# Altium schematic sheet IMD.SchDoc
size A4
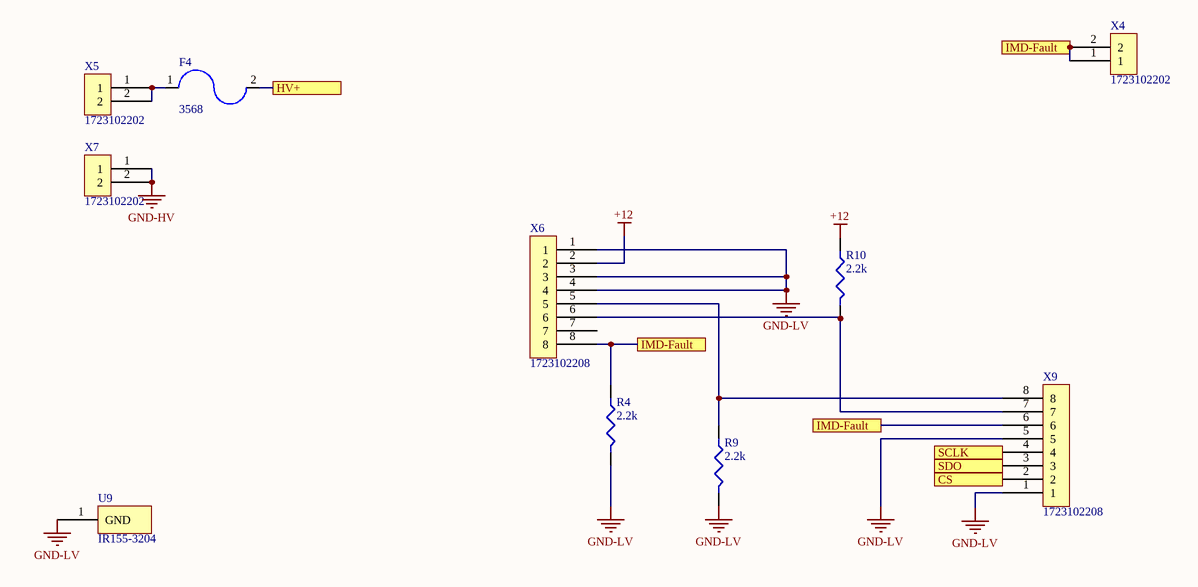
[diagram p0: IMD.SchDoc]

## Parts
F4  3568  [FUSE_MINI_HOLDER]
R4  2.2k  [R0805]
R9  2.2k  [R0805]
R10  2.2k  [R0805]
U9  IR155-3204  [IR155-3204]
X4  1723102202  [Molex2Pin]
X5  1723102202  [Molex2Pin]
X6  1723102208  [Molex8Pin]
X7  1723102202  [Molex2Pin]
X9  1723102208  [Molex8Pin]

## Ports
CS, HV+, IMD-Fault, SCLK, SDO

## Nets
+12: R10.1 X6.2
GND-HV: X7.1 X7.2
GND-LV: R4.2 R9.2 U9.1(GND) X6.1 X6.3 X6.4 X9.1 X9.5
CS: X9.2 ; port CS
HV+: F4.2 ; port HV+
IMD-Fault: R4.1 X4.1 X4.2 X6.8 X9.6 ; port IMD-Fault
SCLK: X9.4 ; port SCLK
SDO: X9.3 ; port SDO
NetF4_1: F4.1 X5.1 X5.2
NetR9_1: R9.1 X6.5 X9.8
NetR10_2: R10.2 X6.6 X9.7

Not connected (* = marked no-connect by the designer): X6 7

## Library data of the parts
F4 = 3568: FUSE HOLDER MINI AUTO PC; Manufacturer: Keystone Electronics; Colour: Black; Material: Brass,Nickel,Tin,Nylon; Body Material: Nylon; Current Rating: 20A; Voltage Rating (AC): 500V; Number of Poles: 1; Illumination Type: Illuminated; Fuse Type: Automotive; Approvals: UL; Supplier 1: Digi-Key; Manufacturer Part Number: 3568; Stock 1: 69840; Pricing 1: 1=0.98, 10=0.853, 50=0.7694, 100=0.7359, 250=0.669, 1000=0.599, 2500=0.502, 5000=0.4683 (USD); Mount: Vertical,PCB; Contact Material: Brass,Nickel,Tin; Contact Plating: Tin; Min Operating Temperature: -50°C; Max Operating Temperature: 145°C; Package Quantity: 1; Number of Circuits: 1; Voltage: 500V; Termination: PC Pin; Fuse Current: 20A; Orientation: Vertical; Length: 16mm; Depth: 6.73mm; REACH SVHC: No SVHC; Lead Free: Lead Free; Flammability Rating: UL94 V-0; ComponentLink1URL: https://datasheet.ciiva.com/16294/m60-2p40-16294706.pdf; ComponentLink1Description: https://datasheet.ciiva.com/16294/m60-2p40-16294706.pdf; ComponentLink2URL: https://datasheet.ciiva.com/16874/70182101-16874378.pdf; ComponentLink2Description: https://datasheet.ciiva.com/16874/70182101-16874378.pdf; Supplier Part Number 1: 36-3568-ND
R4 R9 R10 = RC0805JR-072K2L: RES SMD 2.2K OHM 5% 1/8W; Manufacturer: Yageo; Resistance: 2.2kR; Temperature Coefficient: 100ppm/°C; Power Rating: 125mW; Voltage Rating: 150V; Supplier 1: Digi-Key; Manufacturer Part Number: RC0805JR-072K2L; Stock 1: 810523; Pricing 1: 1=0.1, 10=0.019, 100=0.0076, 1000=0.0034, 2500=0.003 (USD); Case/Package: 0805; Contact Plating: Tin,Lead,Matte; Case Code (Imperial): 0805; Case Code (Metric): 2012; Min Operating Temperature: -55°C; Max Operating Temperature: 155°C; Tolerance: 5%; Packaging: Tape and Reel; Composition: Thick Film; Termination: SMD/SMT; Military Standard: Not; Length: 2mm; Depth: 1.25mm; Radiation Hardening: No; REACH SVHC: Unknown; Lead Free: Lead Free; ComponentLink1URL: https://datasheet.ciiva.com/12667/rc0805-12667397.pdf; ComponentLink1Description: https://datasheet.ciiva.com/12667/rc0805-12667397.pdf; ComponentLink2URL: https://datasheet.ciiva.com/15190/getdatasheetpartid-251869-15190044.pdf; ComponentLink2Description: https://datasheet.ciiva.com/15190/getdatasheetpartid-251869-15190044.pdf; ComponentLink3URL: https://datasheet.ciiva.com/7941/442941-7941935.pdf; ComponentLink3Description: https://datasheet.ciiva.com/7941/442941-7941935.pdf; Supplier Part Number 1: 311-2.2KARCT-ND
U9 = IR155-3204: IMD; Manufacturer: Bender; Supplier 1: Digi-Key; Manufacturer Part Number: IR155-3204
X4 X5 X7 = 1723102202: CONN HEADER R/A 2POS 3.5MM; Manufacturer: Molex; Supplier 1: Digi-Key; Manufacturer Part Number: 1723102202
X6 X9 = 1723102208: CONN HEADER R/A 8POS 3.5MM; Manufacturer: Molex; Supplier 1: Digi-Key; Manufacturer Part Number: 1723102208